# Altium project Laser.PrjPCB
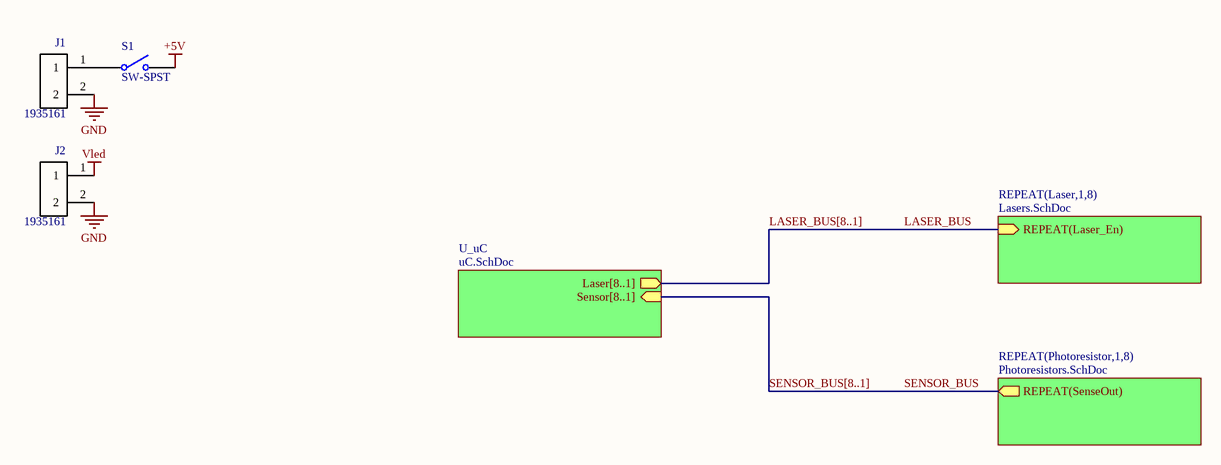
[diagram p0: Laser_Harp_Top.SchDoc]
4 sheets, 70 parts. Net scope: hierarchical (ports join the sheet entries above them; power ports are global).
Board file: Laser.PcbDoc
Sheets:
  Laser_Harp_Top.SchDoc
    Laser1 = Lasers.SchDoc
    Laser2 = Lasers.SchDoc
    Laser3 = Lasers.SchDoc
    Laser4 = Lasers.SchDoc
    Laser5 = Lasers.SchDoc
    Laser6 = Lasers.SchDoc
    Laser7 = Lasers.SchDoc
    Laser8 = Lasers.SchDoc
    Photoresistor1 = Photoresistors.SchDoc
    Photoresistor2 = Photoresistors.SchDoc
    Photoresistor3 = Photoresistors.SchDoc
    Photoresistor4 = Photoresistors.SchDoc
    Photoresistor5 = Photoresistors.SchDoc
    Photoresistor6 = Photoresistors.SchDoc
    Photoresistor7 = Photoresistors.SchDoc
    Photoresistor8 = Photoresistors.SchDoc
    U_uC = uC.SchDoc

## Sheet Laser_Harp_Top.SchDoc
size Letter

### Parts
J1  1935161  [PHOENIX_1935161]
J2  1935161  [PHOENIX_1935161]
S1  SW-SPST  [SPST-2]

### Sub-sheets
REPEAT(Laser,1,8) = Lasers.SchDoc: REPEAT(Laser_En) (in)
REPEAT(Photoresistor,1,8) = Photoresistors.SchDoc: REPEAT(SenseOut) (out)
U_uC = uC.SchDoc: Laser[8..1] (out), Sensor[8..1] (in)

### Nets
+5V: S1.2(NO)
GND: J1.2 J2.2
Vled: J2.1
LASER_BUS: sheet REPEAT(Laser,1,8)/REPEAT(Laser_En)
SENSOR_BUS: sheet REPEAT(Photoresistor,1,8)/REPEAT(SenseOut)
NetJ1_1: J1.1 S1.1(COMMON)

### Buses and harness runs
bus LASER_BUS[8..1] = sheet U_uC/Laser[8..1]
bus SENSOR_BUS[8..1] = sheet U_uC/Sensor[8..1]

### Notes on the sheet
- Title
- Size:
- Date:
- Letter
- Number:
- Time:
- Revision:
- Sheet
- of
- File:

### Library data of the parts
J1 J2 = 1935161: Conn Terminal Blocks 2 POS 5mm Solder ST Thru-Hole 16A; MF: Phoenix Contact; Digi-Key_Part_Number: 277-1667-ND; Package: None; SnapEDA_Link: https://www.snapeda.com/parts/1935161/Phoenix%20Contact/view-part/?ref=snap; MP: 1935161; Digi-Key_Purchase_URL: https://www.digikey.com/product-detail/en/phoenix-contact/1935161/277-1667-ND/568614?utm_source=snapeda&utm_medium=aggregator&utm_campaign=symbol; Value: *
S1 = SW-SPST: Single-Pole, Single-Throw Switch; Published: 24-Mar-1999; LatestRevisionDate: 17-Jul-2002; LatestRevisionNote: Re-released for DXP Platform.; PackageReference: SPST-2; Publisher: Altium Limited

## Sheet Lasers.SchDoc
size Letter
Used 8 times, as channels Laser1, Laser2, Laser3, Laser4, Laser5, Laser6, Laser7, Laser8. Parts and nets are listed once, with the designators drawn on the sheet.
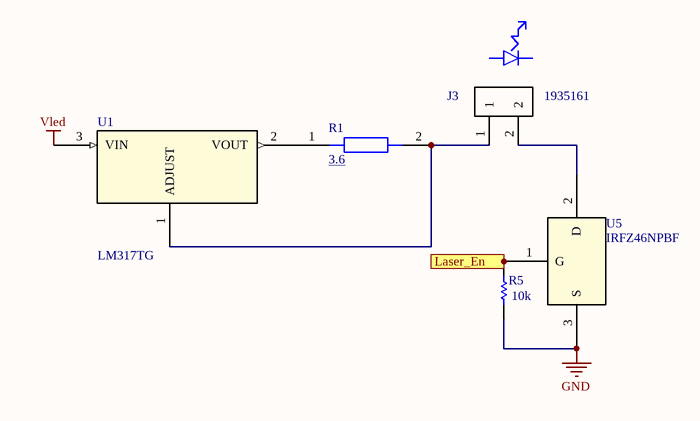
[diagram p1: Lasers.SchDoc]

### Parts
J3  1935161  [PHOENIX_1935161]
R1  3.6  [3.6_R]
R5  value 10k  [AXIAL-0.3]  (hidden comment: Res1)
U1  LM317TG  [TO-220AB]
U5  IRFZ46NPBF  [TO-220AB]

### Ports
Laser_En (in)

### Nets
GND: R5.1 U5.3(S)
Vled: U1.3(VIN)
Laser_En: R5.2 U5.1(G) ; port Laser_En
NetJ3_1: J3.1 R1.2 U1.1(ADJUST)
NetJ3_2: J3.2 U5.2(D)
NetR1_1: R1.1 U1.2(VOUT)

### Channels
Laser1: designators end in _Laser1; ports Laser_En=Laser1
Laser2: designators end in _Laser2; ports Laser_En=Laser2
Laser3: designators end in _Laser3; ports Laser_En=Laser3
Laser4: designators end in _Laser4; ports Laser_En=Laser4
Laser5: designators end in _Laser5; ports Laser_En=Laser5
Laser6: designators end in _Laser6; ports Laser_En=Laser6
Laser7: designators end in _Laser7; ports Laser_En=Laser7
Laser8: designators end in _Laser8; ports Laser_En=Laser8

### Notes on the sheet
- Title
- Size:
- Date:
- Letter
- Number:
- Time:
- Revision:
- Sheet
- of
- File:

### Library data of the parts
J3 = 1935161: as J1 on sheet Laser_Harp_Top; Digi-Key_Part_Number: 277-1667-ND; Package: None; SnapEDA_Link: https://www.snapeda.com/parts/1935161/Phoenix%20Contact/view-part/?ref=snap; MP: 1935161; Digi-Key_Purchase_URL: https://www.digikey.com/product-detail/en/phoenix-contact/1935161/277-1667-ND/568614?utm_source=snapeda&utm_medium=aggregator&utm_campaign=symbol; Value: *
R5 = Res1: Resistor; Published: 8-Jun-2000; LatestRevisionDate: 17-Jul-2002; LatestRevisionNote: Re-released for DXP Platform.; PackageReference: AXIAL-0.3; Publisher: Altium Limited
U1 = LM317TG: Imported; Vendor: ON Semiconductor; Built_By: EMA_UL_Team; C: Copyright (C) 2015 Accelerated Designs. All rights reserved; Manufacturer_Part_Number: LM317TG; RefDes: RefDes; Type: DEV; Value: Value
U5 = IRFZ46NPBF: Imported; Vendor: LITE-ON; Built_By: EMA_UL_Team; C: Copyright (C) 2015 Accelerated Designs. All rights reserved; Manufacturer_Part_Number: IRFZ46NPBF; RefDes: RefDes; Type: DEV; Value: Value

## Sheet Photoresistors.SchDoc
size Letter
Used 8 times, as channels Photoresistor1, Photoresistor2, Photoresistor3, Photoresistor4, Photoresistor5, Photoresistor6, Photoresistor7, Photoresistor8. Parts and nets are listed once, with the designators drawn on the sheet.
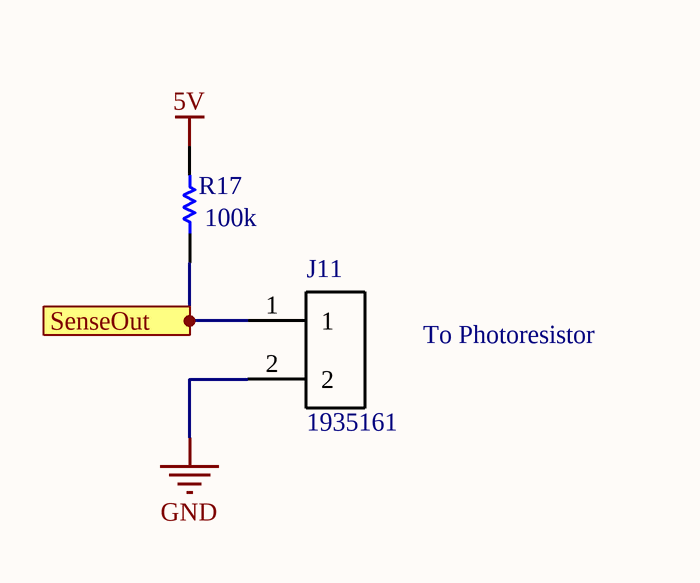
[diagram p2: Photoresistors.SchDoc]

### Parts
J11  1935161  [PHOENIX_1935161]
R17  value 100k  [AXIAL-0.3]  (hidden comment: Res1)

### Ports
SenseOut (out)

### Nets
5V: R17.2
GND: J11.2
SenseOut: J11.1 R17.1 ; port SenseOut

### Channels
Photoresistor1: designators end in _Photoresistor1; ports SenseOut=Sensor1
Photoresistor2: designators end in _Photoresistor2; ports SenseOut=Sensor2
Photoresistor3: designators end in _Photoresistor3; ports SenseOut=Sensor3
Photoresistor4: designators end in _Photoresistor4; ports SenseOut=Sensor4
Photoresistor5: designators end in _Photoresistor5; ports SenseOut=Sensor5
Photoresistor6: designators end in _Photoresistor6; ports SenseOut=Sensor6
Photoresistor7: designators end in _Photoresistor7; ports SenseOut=Sensor7
Photoresistor8: designators end in _Photoresistor8; ports SenseOut=Sensor8

### Notes on the sheet
- To Photoresistor
- Title
- Size:
- Date:
- Letter
- Number:
- Time:
- Revision:
- Sheet
- of
- File:

### Library data of the parts
J11 = 1935161: as J1 on sheet Laser_Harp_Top; Digi-Key_Part_Number: 277-1667-ND; Package: None; SnapEDA_Link: https://www.snapeda.com/parts/1935161/Phoenix%20Contact/view-part/?ref=snap; MP: 1935161; Digi-Key_Purchase_URL: https://www.digikey.com/product-detail/en/phoenix-contact/1935161/277-1667-ND/568614?utm_source=snapeda&utm_medium=aggregator&utm_campaign=symbol; Value: *
R17 = Res1: Resistor; Published: 8-Jun-2000; LatestRevisionDate: 17-Jul-2002; LatestRevisionNote: Re-released for DXP Platform.; PackageReference: AXIAL-0.3; Publisher: Altium Limited

## Sheet uC.SchDoc
size Letter
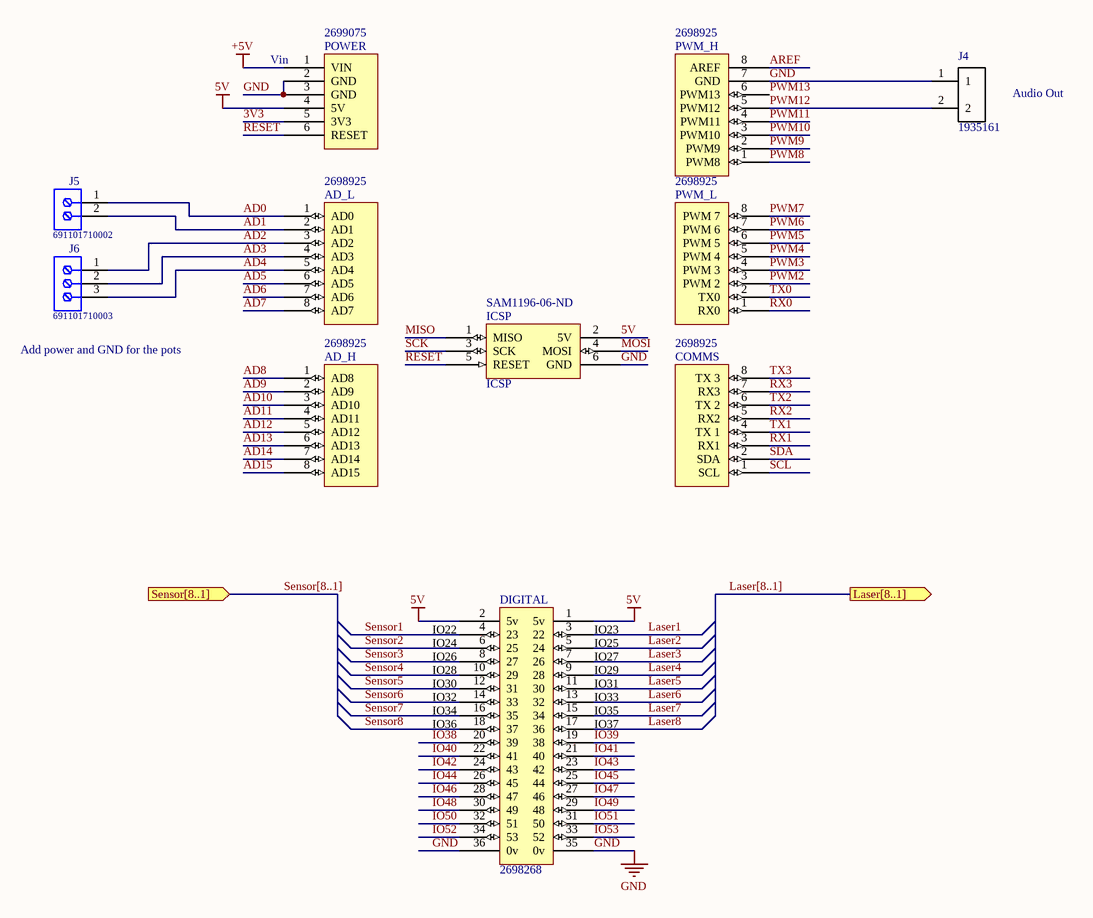
[diagram p3: uC.SchDoc]

### Parts
AD_H  Supplier Part Number 4: 2698925  [Header 8x1 8.5mm]  (hidden comment: AD_H)
AD_L  Supplier Part Number 5: 2698925  [Header 8x1 8.5mm]  (hidden comment: AD_L)
COMMS  Supplier Part Number 4: 2698925  [Header 8x1 8.5mm]  (hidden comment: Communication)
DIGITAL  Supplier Part Number 5: 2698268  [HEADER 36X 8MM]  (hidden comment: IO_36)
ICSP  ICSP  Supplier Part Number 5: SAM1196-06-ND  [ICSP]
J4  1935161  [PHOENIX_1935161]
J5  691101710002  [691101710002]
J6  691101710003  [691101710003]
POWER  Supplier Part Number 2: 2699075  [Header 6x1 8.5mm]  (hidden comment: POWER)
PWM_H  Supplier Part Number 4: 2698925  [Header 8x1 8.5mm]  (hidden comment: PWM_H)
PWM_L  Supplier Part Number 4: 2698925  [Header 8x1 8.5mm]  (hidden comment: PWM_L)

### Ports
Laser[8..1] (out), Sensor[8..1] (in)

### Nets
5V: DIGITAL.1(5v) DIGITAL.2(5v) ICSP.2(5V) POWER.4(5V)
+5V: POWER.1(VIN)
GND: DIGITAL.35(0v) DIGITAL.36(0v) ICSP.6(GND) J4.1 POWER.2(GND) POWER.3(GND) PWM_H.7(GND)
3V3: POWER.5(3V3)
AD0: AD_L.1(AD0) J5.1
AD1: AD_L.2(AD1) J5.2
AD2: AD_L.3(AD2) J6.1
AD3: AD_L.4(AD3) J6.2
AD4: AD_L.5(AD4) J6.3
AD5: AD_L.6(AD5)
AD6: AD_L.7(AD6)
AD7: AD_L.8(AD7)
AD8: AD_H.1(AD8)
AD9: AD_H.2(AD9)
AD10: AD_H.3(AD10)
AD11: AD_H.4(AD11)
AD12: AD_H.5(AD12)
AD13: AD_H.6(AD13)
AD14: AD_H.7(AD14)
AD15: AD_H.8(AD15)
AREF: PWM_H.8(AREF)
IO38: DIGITAL.20(39)
IO39: DIGITAL.19(38)
IO40: DIGITAL.22(41)
IO41: DIGITAL.21(40)
IO42: DIGITAL.24(43)
IO43: DIGITAL.23(42)
IO44: DIGITAL.26(45)
IO45: DIGITAL.25(44)
IO46: DIGITAL.28(47)
IO47: DIGITAL.27(46)
IO48: DIGITAL.30(49)
IO49: DIGITAL.29(48)
IO50: DIGITAL.32(51)
IO51: DIGITAL.31(50)
IO52: DIGITAL.34(53)
IO53: DIGITAL.33(52)
Laser1: DIGITAL.3(22)
Laser2: DIGITAL.5(24)
Laser3: DIGITAL.7(26)
Laser4: DIGITAL.9(28)
Laser5: DIGITAL.11(30)
Laser6: DIGITAL.13(32)
Laser7: DIGITAL.15(34)
Laser8: DIGITAL.17(36)
MISO: ICSP.1(MISO)
MOSI: ICSP.4(MOSI)
PWM2: PWM_L.3(PWM_2)
PWM3: PWM_L.4(PWM_3)
PWM4: PWM_L.5(PWM_4)
PWM5: PWM_L.6(PWM_5)
PWM6: PWM_L.7(PWM_6)
PWM7: PWM_L.8(PWM_7)
PWM8: PWM_H.1(PWM8)
PWM9: PWM_H.2(PWM9)
PWM10: PWM_H.3(PWM10)
PWM11: PWM_H.4(PWM11)
PWM12: J4.2 PWM_H.5(PWM12)
PWM13: PWM_H.6(PWM13)
RESET: ICSP.5(RESET) POWER.6(RESET)
RX0: PWM_L.1(RX0)
RX1: COMMS.3(RX1)
RX2: COMMS.5(RX2)
RX3: COMMS.7(RX3)
SCK: ICSP.3(SCK)
SCL: COMMS.1(SCL)
SDA: COMMS.2(SDA)
Sensor1: DIGITAL.4(23)
Sensor2: DIGITAL.6(25)
Sensor3: DIGITAL.8(27)
Sensor4: DIGITAL.10(29)
Sensor5: DIGITAL.12(31)
Sensor6: DIGITAL.14(33)
Sensor7: DIGITAL.16(35)
Sensor8: DIGITAL.18(37)
TX0: PWM_L.2(TX0)
TX1: COMMS.4(TX_1)
TX2: COMMS.6(TX_2)
TX3: COMMS.8(TX_3)

### Buses and harness runs
bus Laser[8..1] = port Laser[8..1]
bus Sensor[8..1] = port Sensor[8..1]

### Notes on the sheet
- (near POWER) Vin
- Audio Out
- (near J6) Add power and GND for the pots
- (near DIGITAL) IO22
  IO24
  IO26
  IO28
  IO30
  IO32
  IO34
  IO36
- (near DIGITAL) IO23
  IO25
  IO27
  IO29
  IO31
  IO33
  IO35
  IO37
- Title
- Size:
- Date:
- Letter
- Number:
- Time:
- Revision:
- Sheet
- of
- File:

### Library data of the parts
J4 = 1935161: as J1 on sheet Laser_Harp_Top; Digi-Key_Part_Number: 277-1667-ND; Package: None; SnapEDA_Link: https://www.snapeda.com/parts/1935161/Phoenix%20Contact/view-part/?ref=snap; MP: 1935161; Digi-Key_Purchase_URL: https://www.digikey.com/product-detail/en/phoenix-contact/1935161/277-1667-ND/568614?utm_source=snapeda&utm_medium=aggregator&utm_campaign=symbol; Value: *
J5 = 691101710002: Series 101 - 5.00 mm Horizontal Entry Modular with Pressure Clamp WR-TBL, 2 pin; Pin Number: 2; Pitch: 5.00 mm; ComponentLink1Description: Manufacturer; ComponentLink1URL: http://www.we-online.de; ComponentLink2Description: Datasheet; ComponentLink2URL: http://katalog.we-online.de/em/datasheet/6911017100xx.pdf; Part Number: 691101710002; Published Date: May 2018; Publisher: Wurth Elektronik; Operating Temperature: -40 to 105 degC; Mounting Technology: THT; Packaging: Box
J6 = 691101710003: Series 101 - 5.00 mm Horizontal Entry Modular with Pressure Clamp WR-TBL, 3 pin; Pin Number: 3; Pitch: 5.00 mm; ComponentLink1Description: Manufacturer; ComponentLink1URL: http://www.we-online.de; ComponentLink2Description: Datasheet; ComponentLink2URL: http://katalog.we-online.de/em/datasheet/6911017100xx.pdf; Part Number: 691101710003; Published Date: May 2018; Publisher: Wurth Elektronik; Operating Temperature: -40 to 105 degC; Mounting Technology: THT; Packaging: Box
AD_H = AD_H: Supplier 1: Arrow; Supplier Part Number 1: 2698940; Supplier 2: Arrow; Supplier Part Number 2: 2698939; Supplier 3: Digi-Key; Supplier Part Number 3: SAM1198-08-ND; Supplier 4: Arrow
AD_L = AD_L: Supplier 1: Digi-Key; Supplier Part Number 1: SAM1198-08-ND; Supplier 2: Arrow; Supplier Part Number 2: 2698939; Supplier 3: Arrow; Supplier Part Number 3: 2698940; Supplier 4: Arrow; Supplier Part Number 4: 43085273; Supplier 5: Arrow
COMMS = Communication: Supplier 1: Digi-Key; Supplier Part Number 1: SAM1198-08-ND; Supplier 2: Arrow; Supplier Part Number 2: 2698940; Supplier 3: Arrow; Supplier Part Number 3: 2698939; Supplier 4: Arrow
DIGITAL = IO_36: Supplier 1: Digi-Key; Supplier Part Number 1: SAM1196-18-ND; Supplier 2: Arrow; Supplier Part Number 2: 48117090; Supplier 3: Arrow; Supplier Part Number 3: 46093326; Supplier 4: Arrow; Supplier Part Number 4: 2698278; Supplier 5: Arrow
ICSP = ICSP: Supplier 1: Digi-Key; Supplier Part Number 1: SAM1185-06-ND; Supplier 2: Arrow; Supplier Part Number 2: 2699117; Supplier 3: Arrow; Supplier Part Number 3: 43862781; Supplier 4: Arrow; Supplier Part Number 4: 2699091; Supplier 5: Digi-Key
POWER = POWER: Supplier 1: Arrow; Supplier Part Number 1: 52553843; Supplier 2: Arrow; Supplier 3: Digi-Key; Supplier Part Number 3: SAM1198-06-ND; Supplier 4: Arrow; Supplier Part Number 4: 2699089; Supplier 5: Arrow; Supplier Part Number 5: 2699088
PWM_H = PWM_H: Supplier 1: Digi-Key; Supplier Part Number 1: SAM1198-08-ND; Supplier 2: Arrow; Supplier Part Number 2: 2698940; Supplier 3: Arrow; Supplier Part Number 3: 2698939; Supplier 4: Arrow
PWM_L = PWM_L: Supplier 1: Arrow; Supplier Part Number 1: 2698940; Supplier 2: Arrow; Supplier Part Number 2: 2698939; Supplier 3: Digi-Key; Supplier Part Number 3: SAM1198-08-ND; Supplier 4: Arrow

## Nets that join several sheets
5V: Photoresistor1 (R17_Photoresistor1.2), Photoresistor2 (R17_Photoresistor2.2), Photoresistor3 (R17_Photoresistor3.2), Photoresistor4 (R17_Photoresistor4.2), Photoresistor5 (R17_Photoresistor5.2), Photoresistor6 (R17_Photoresistor6.2), Photoresistor7 (R17_Photoresistor7.2), Photoresistor8 (R17_Photoresistor8.2), uC (DIGITAL.1 DIGITAL.2 ICSP.2 POWER.4)
+5V: Laser_Harp_Top (S1.2), uC (POWER.1)
GND: Laser_Harp_Top (J1.2 J2.2), Laser1 (R5_Laser1.1 U5_Laser1.3), Laser2 (R5_Laser2.1 U5_Laser2.3), Laser3 (R5_Laser3.1 U5_Laser3.3), Laser4 (R5_Laser4.1 U5_Laser4.3), Laser5 (R5_Laser5.1 U5_Laser5.3), Laser6 (R5_Laser6.1 U5_Laser6.3), Laser7 (R5_Laser7.1 U5_Laser7.3), Laser8 (R5_Laser8.1 U5_Laser8.3), Photoresistor1 (J11_Photoresistor1.2), Photoresistor2 (J11_Photoresistor2.2), Photoresistor3 (J11_Photoresistor3.2), Photoresistor4 (J11_Photoresistor4.2), Photoresistor5 (J11_Photoresistor5.2), Photoresistor6 (J11_Photoresistor6.2), Photoresistor7 (J11_Photoresistor7.2), Photoresistor8 (J11_Photoresistor8.2), uC (7 pins)
Vled: Laser_Harp_Top (J2.1), Laser1 (U1_Laser1.3), Laser2 (U1_Laser2.3), Laser3 (U1_Laser3.3), Laser4 (U1_Laser4.3), Laser5 (U1_Laser5.3), Laser6 (U1_Laser6.3), Laser7 (U1_Laser7.3), Laser8 (U1_Laser8.3)
Laser1: Laser1 (R5_Laser1.2 U5_Laser1.1), uC (DIGITAL.3)
Laser2: Laser2 (R5_Laser2.2 U5_Laser2.1), uC (DIGITAL.5)
Laser3: Laser3 (R5_Laser3.2 U5_Laser3.1), uC (DIGITAL.7)
Laser4: Laser4 (R5_Laser4.2 U5_Laser4.1), uC (DIGITAL.9)
Laser5: Laser5 (R5_Laser5.2 U5_Laser5.1), uC (DIGITAL.11)
Laser6: Laser6 (R5_Laser6.2 U5_Laser6.1), uC (DIGITAL.13)
Laser7: Laser7 (R5_Laser7.2 U5_Laser7.1), uC (DIGITAL.15)
Laser8: Laser8 (R5_Laser8.2 U5_Laser8.1), uC (DIGITAL.17)
Sensor1: Photoresistor1 (J11_Photoresistor1.1 R17_Photoresistor1.1), uC (DIGITAL.4)
Sensor2: Photoresistor2 (J11_Photoresistor2.1 R17_Photoresistor2.1), uC (DIGITAL.6)
Sensor3: Photoresistor3 (J11_Photoresistor3.1 R17_Photoresistor3.1), uC (DIGITAL.8)
Sensor4: Photoresistor4 (J11_Photoresistor4.1 R17_Photoresistor4.1), uC (DIGITAL.10)
Sensor5: Photoresistor5 (J11_Photoresistor5.1 R17_Photoresistor5.1), uC (DIGITAL.12)
Sensor6: Photoresistor6 (J11_Photoresistor6.1 R17_Photoresistor6.1), uC (DIGITAL.14)
Sensor7: Photoresistor7 (J11_Photoresistor7.1 R17_Photoresistor7.1), uC (DIGITAL.16)
Sensor8: Photoresistor8 (J11_Photoresistor8.1 R17_Photoresistor8.1), uC (DIGITAL.18)